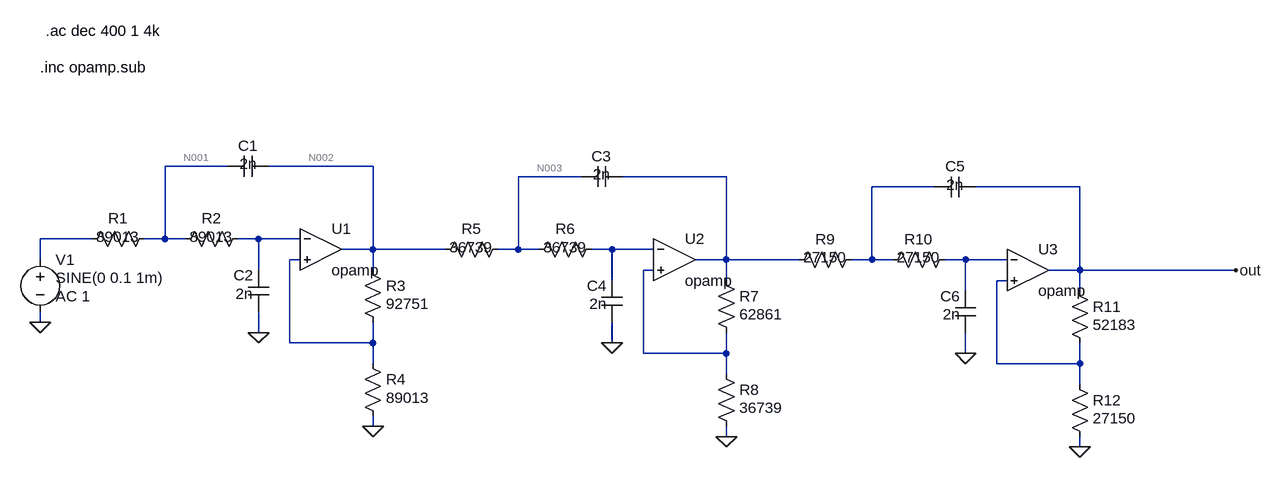
[diagram p0: schematic Active filter.asc]
Active filter.asc, the LTspice schematic file:
Version 4
SHEET 1 2056 964
WIRE 448 16 352 16
WIRE 672 16 512 16
WIRE 992 32 896 32
WIRE 1216 32 1056 32
WIRE 1536 48 1440 48
WIRE 1760 48 1600 48
WIRE 240 128 160 128
WIRE 352 128 352 16
WIRE 352 128 320 128
WIRE 384 128 352 128
WIRE 496 128 464 128
WIRE 560 128 496 128
WIRE 672 144 672 16
WIRE 672 144 624 144
WIRE 784 144 672 144
WIRE 896 144 896 32
WIRE 896 144 864 144
WIRE 928 144 896 144
WIRE 1040 144 1008 144
WIRE 1104 144 1040 144
WIRE 160 160 160 128
WIRE 560 160 544 160
WIRE 1216 160 1216 32
WIRE 1216 160 1168 160
WIRE 1328 160 1216 160
WIRE 1440 160 1440 48
WIRE 1440 160 1408 160
WIRE 1472 160 1440 160
WIRE 1584 160 1552 160
WIRE 1648 160 1584 160
WIRE 496 176 496 128
WIRE 672 176 672 144
WIRE 1104 176 1088 176
WIRE 1760 176 1760 48
WIRE 1760 176 1712 176
WIRE 2000 176 1760 176
WIRE 1040 192 1040 144
WIRE 1216 192 1216 160
WIRE 1648 192 1632 192
WIRE 1584 208 1584 160
WIRE 1760 208 1760 176
WIRE 160 256 160 240
WIRE 496 272 496 240
WIRE 544 288 544 160
WIRE 672 288 672 256
WIRE 672 288 544 288
WIRE 1040 288 1040 256
WIRE 1088 304 1088 176
WIRE 1216 304 1216 272
WIRE 1216 304 1088 304
WIRE 1584 304 1584 272
WIRE 672 320 672 288
WIRE 1632 320 1632 192
WIRE 1760 320 1760 288
WIRE 1760 320 1632 320
WIRE 1216 336 1216 304
WIRE 1760 352 1760 320
WIRE 672 416 672 400
WIRE 1216 432 1216 416
WIRE 1760 448 1760 432
FLAG 160 256 0
FLAG 496 272 0
FLAG 672 416 0
FLAG 1040 288 0
FLAG 1216 432 0
FLAG 1584 304 0
FLAG 2000 176 out
FLAG 1760 448 0
SYMBOL res 480 112 R90
WINDOW 0 0 56 VBottom 2
WINDOW 3 28 56 VBottom 2
SYMATTR InstName R2
SYMATTR Value 89013
SYMBOL cap 512 0 R90
WINDOW 0 0 32 VBottom 2
WINDOW 3 28 32 VBottom 2
SYMATTR InstName C1
SYMATTR Value 2n
SYMBOL cap 512 240 R180
WINDOW 0 24 56 Left 2
WINDOW 3 24 28 Left 2
SYMATTR InstName C2
SYMATTR Value 2n
SYMBOL OpAmps\\opamp 592 80 R0
SYMATTR InstName U1
SYMBOL res 656 160 R0
WINDOW 3 36 68 Left 2
SYMATTR Value 92751
SYMATTR InstName R3
SYMBOL res 656 304 R0
WINDOW 3 36 68 Left 2
SYMATTR Value 89013
SYMATTR InstName R4
SYMBOL voltage 160 144 R0
WINDOW 123 24 72 Left 2
WINDOW 39 0 0 Left 0
WINDOW 3 24 44 Left 2
SYMATTR Value2 AC 1
SYMATTR Value SINE(0 0.1 1m)
SYMATTR InstName V1
SYMBOL res 880 128 R90
WINDOW 0 0 56 VBottom 2
WINDOW 3 28 56 VBottom 2
SYMATTR InstName R5
SYMATTR Value 36739
SYMBOL res 1024 128 R90
WINDOW 0 0 56 VBottom 2
WINDOW 3 28 56 VBottom 2
SYMATTR InstName R6
SYMATTR Value 36739
SYMBOL cap 1056 16 R90
WINDOW 0 0 32 VBottom 2
WINDOW 3 28 32 VBottom 2
SYMATTR InstName C3
SYMATTR Value 2n
SYMBOL cap 1056 256 R180
WINDOW 0 24 56 Left 2
WINDOW 3 24 28 Left 2
SYMATTR InstName C4
SYMATTR Value 2n
SYMBOL res 1200 176 R0
WINDOW 3 36 68 Left 2
SYMATTR Value 62861
SYMATTR InstName R7
SYMBOL res 1200 320 R0
WINDOW 3 36 68 Left 2
SYMATTR Value 36739
SYMATTR InstName R8
SYMBOL res 1424 144 R90
WINDOW 0 0 56 VBottom 2
WINDOW 3 28 56 VBottom 2
SYMATTR InstName R9
SYMATTR Value 27150
SYMBOL res 1568 144 R90
WINDOW 0 0 56 VBottom 2
WINDOW 3 28 56 VBottom 2
SYMATTR InstName R10
SYMATTR Value 27150
SYMBOL cap 1600 32 R90
WINDOW 0 0 32 VBottom 2
WINDOW 3 28 32 VBottom 2
SYMATTR InstName C5
SYMATTR Value 2n
SYMBOL cap 1600 272 R180
WINDOW 0 24 56 Left 2
WINDOW 3 24 28 Left 2
SYMATTR InstName C6
SYMATTR Value 2n
SYMBOL res 1744 192 R0
WINDOW 3 36 68 Left 2
SYMATTR Value 52183
SYMATTR InstName R11
SYMBOL res 1744 336 R0
WINDOW 3 36 68 Left 2
SYMATTR Value 27150
SYMATTR InstName R12
SYMBOL res 336 112 R90
WINDOW 0 0 56 VBottom 2
WINDOW 3 28 56 VBottom 2
SYMATTR InstName R1
SYMATTR Value 89013
SYMBOL OpAmps\\opamp 1136 96 R0
SYMATTR InstName U2
SYMBOL OpAmps\\opamp 1680 112 R0
SYMATTR InstName U3
TEXT 160 -136 Left 2 !.inc opamp.sub
TEXT 168 -192 Left 2 !.ac dec 400 1 4k

The netlist it stands for:
* Active filter.asc
R2 N007 N001 89013
C1 N002 N001 2n
C2 0 N007 2n
XU1 N007 N009 N002 opamp Aol=100K GBW=10Meg  ; pins invin noninvin out
R3 N002 N009 92751
R4 N009 0 89013
V1 N006 0 SINE(0 0.1 1m) AC 1
R5 N003 N002 36739
R6 N008 N003 36739
C3 N004 N003 2n
C4 0 N008 2n
R7 N004 N011 62861
R8 N011 0 36739
R9 N005 N004 27150
R10 N010 N005 27150
C5 out N005 2n
C6 0 N010 2n
R11 out N012 52183
R12 N012 0 27150
R1 N001 N006 89013
XU2 N008 N011 N004 opamp Aol=100K GBW=10Meg  ; pins invin noninvin out
XU3 N010 N012 out opamp Aol=100K GBW=10Meg  ; pins invin noninvin out
.inc opamp.sub
.ac dec 400 1 4k
.backanno
.end

* Results of the author's LTspice run, read from the files saved beside the schematic
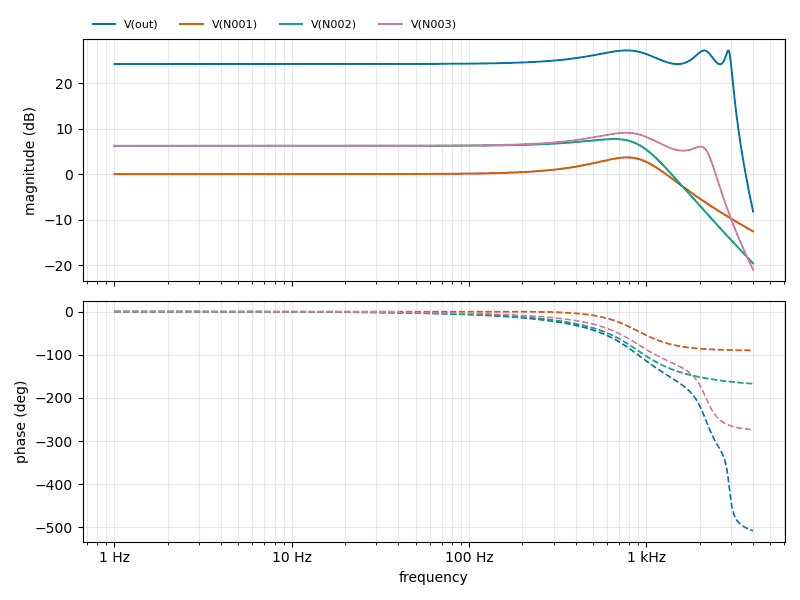
[diagram p1: AC Analysis of Active filter.asc, plotted from the saved traces]
* AC Analysis, 1 run:
*   V(out): 24.18 dB at 1 Hz, -8.18 dB at 4 kHz, peak 27.17 dB at 776.2 Hz, 3 dB below the peak at 2.571 kHz
*   V(N001): 0.00 dB at 1 Hz, -12.57 dB at 4 kHz, peak 3.67 dB at 776.2 Hz, 3 dB below the peak at 246.6 Hz and 1.221 kHz
*   V(N002): 6.20 dB at 1 Hz, -19.59 dB at 4 kHz, peak 7.70 dB at 656.9 Hz, 3 dB below the peak at 1.051 kHz
*   V(N003): 6.20 dB at 1 Hz, -20.98 dB at 4 kHz, peak 9.09 dB at 767.4 Hz, 3 dB below the peak at 1.299 kHz